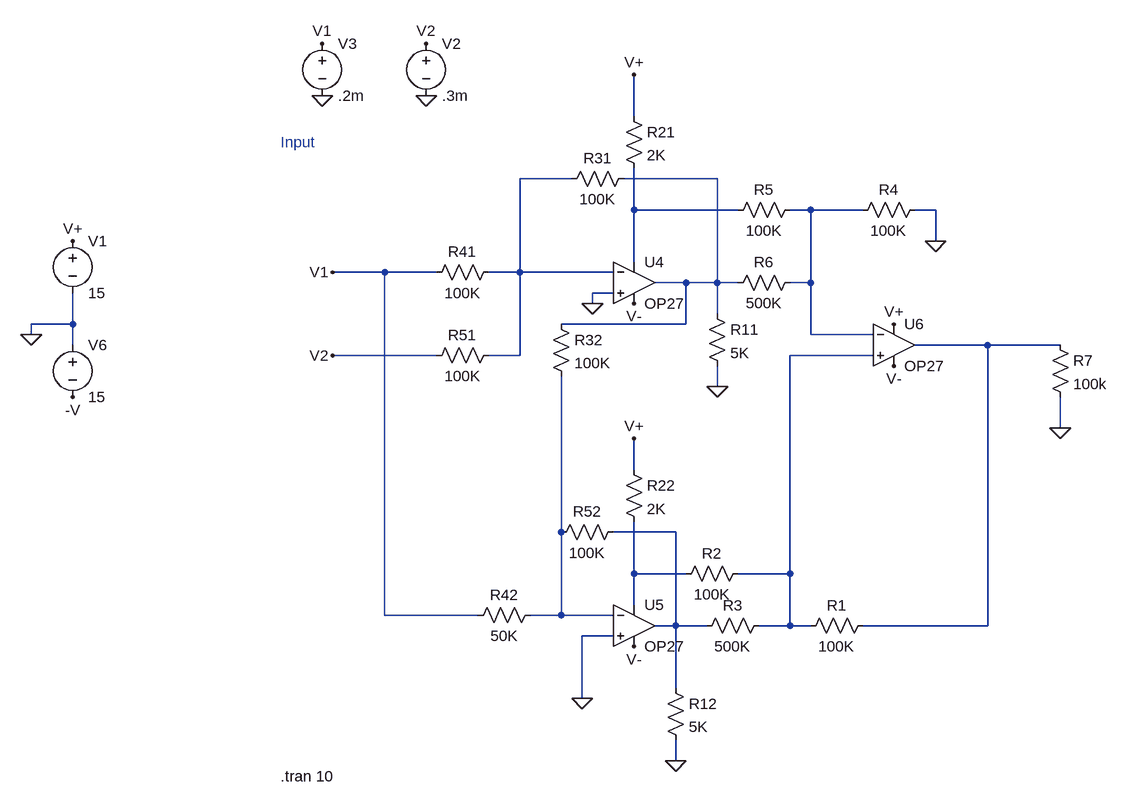
[diagram p0: schematic Multiplier.asc]
Multiplier.asc, the LTspice schematic file:
Version 4
SHEET 1 880 856
WIRE -160 -176 -160 -240
WIRE -256 -80 -336 -80
WIRE -32 -80 -176 -80
WIRE -160 -32 -160 -96
WIRE 0 -32 -160 -32
WIRE 112 -32 80 -32
WIRE 192 -32 112 -32
WIRE 304 -32 272 -32
WIRE 304 16 304 -32
WIRE -160 48 -160 -32
WIRE -544 64 -624 64
WIRE -464 64 -544 64
WIRE -336 64 -336 -80
WIRE -336 64 -384 64
WIRE -192 64 -336 64
WIRE -80 80 -128 80
WIRE -32 80 -32 -80
WIRE -32 80 -80 80
WIRE 0 80 -32 80
WIRE 112 80 112 -32
WIRE 112 80 80 80
WIRE -192 96 -224 96
WIRE -224 112 -224 96
WIRE -32 128 -32 80
WIRE -1024 144 -1024 96
WIRE -1024 144 -1088 144
WIRE -80 144 -80 80
WIRE -80 144 -272 144
WIRE -1088 160 -1088 144
WIRE 112 160 112 80
WIRE 208 160 112 160
WIRE -1024 176 -1024 144
WIRE 384 176 272 176
WIRE 496 176 384 176
WIRE -464 192 -624 192
WIRE -336 192 -336 64
WIRE -336 192 -384 192
WIRE 208 192 80 192
WIRE -32 240 -32 208
WIRE 496 304 496 256
WIRE -160 368 -160 320
WIRE -272 464 -272 224
WIRE -96 464 -192 464
WIRE -160 528 -160 448
WIRE -80 528 -160 528
WIRE 80 528 80 192
WIRE 80 528 0 528
WIRE -160 576 -160 528
WIRE -544 592 -544 64
WIRE -400 592 -544 592
WIRE -272 592 -272 464
WIRE -272 592 -320 592
WIRE -192 592 -272 592
WIRE -96 608 -96 464
WIRE -96 608 -128 608
WIRE -48 608 -96 608
WIRE 80 608 80 528
WIRE 80 608 32 608
WIRE 112 608 80 608
WIRE 384 608 384 176
WIRE 384 608 192 608
WIRE -192 624 -240 624
WIRE -96 704 -96 608
WIRE -240 720 -240 624
WIRE -96 816 -96 784
FLAG 304 16 0
FLAG -240 720 0
FLAG -32 240 0
FLAG -96 816 0
FLAG -224 112 0
FLAG 496 304 0
FLAG -160 -240 V+
FLAG -160 320 V+
FLAG 240 144 V+
FLAG -160 112 V-
FLAG -160 640 V-
FLAG 240 208 V-
FLAG -640 -208 0
FLAG -480 -208 0
FLAG -640 -288 V1
FLAG -480 -288 V2
FLAG -624 64 V1
FLAG -624 192 V2
FLAG -1088 160 0
FLAG -1024 16 V+
FLAG -1024 256 -V
SYMBOL res -176 -192 R0
SYMATTR InstName R21
SYMATTR Value 2K
SYMATTR SpiceLine tol=1
SYMBOL res -368 48 R90
WINDOW 0 0 56 VBottom 2
WINDOW 3 32 56 VTop 2
SYMATTR InstName R41
SYMATTR Value 100K
SYMATTR SpiceLine tol=1
SYMBOL res -368 176 R90
WINDOW 0 0 56 VBottom 2
WINDOW 3 32 56 VTop 2
SYMATTR InstName R51
SYMATTR Value 100K
SYMATTR SpiceLine tol=1
SYMBOL res -304 576 R90
WINDOW 0 0 56 VBottom 2
WINDOW 3 32 56 VTop 2
SYMATTR InstName R42
SYMATTR Value 50K
SYMATTR SpiceLine tol=1
SYMBOL res 96 64 R90
WINDOW 0 0 56 VBottom 2
WINDOW 3 32 56 VTop 2
SYMATTR InstName R6
SYMATTR Value 500K
SYMATTR SpiceLine tol=1
SYMBOL res 96 -48 R90
WINDOW 0 0 56 VBottom 2
WINDOW 3 32 56 VTop 2
SYMATTR InstName R5
SYMATTR Value 100K
SYMATTR SpiceLine tol=1
SYMBOL res -48 112 R0
SYMATTR InstName R11
SYMATTR Value 5K
SYMATTR SpiceLine tol=1
SYMBOL res -160 -96 R90
WINDOW 0 0 56 VBottom 2
WINDOW 3 32 56 VTop 2
SYMATTR InstName R31
SYMATTR Value 100K
SYMATTR SpiceLine tol=1
SYMBOL res 288 -48 R90
WINDOW 0 0 56 VBottom 2
WINDOW 3 32 56 VTop 2
SYMATTR InstName R4
SYMATTR Value 100K
SYMATTR SpiceLine tol=1
SYMBOL res -176 352 R0
SYMATTR InstName R22
SYMATTR Value 2K
SYMATTR SpiceLine tol=1
SYMBOL res 48 592 R90
WINDOW 0 0 56 VBottom 2
WINDOW 3 32 56 VTop 2
SYMATTR InstName R3
SYMATTR Value 500K
SYMATTR SpiceLine tol=1
SYMBOL res 208 592 R90
WINDOW 0 0 56 VBottom 2
WINDOW 3 32 56 VTop 2
SYMATTR InstName R1
SYMATTR Value 100K
SYMATTR SpiceLine tol=1
SYMBOL res 16 512 R90
WINDOW 0 0 56 VBottom 2
WINDOW 3 32 56 VTop 2
SYMATTR InstName R2
SYMATTR Value 100K
SYMATTR SpiceLine tol=1
SYMBOL res -176 448 R90
WINDOW 0 0 56 VBottom 2
WINDOW 3 32 56 VTop 2
SYMATTR InstName R52
SYMATTR Value 100K
SYMATTR SpiceLine tol=1
SYMBOL res -112 688 R0
SYMATTR InstName R12
SYMATTR Value 5K
SYMATTR SpiceLine tol=1
SYMBOL res -288 128 R0
SYMATTR InstName R32
SYMATTR Value 100K
SYMATTR SpiceLine tol=1
SYMBOL OpAmps\\OP27 -160 16 R0
SYMATTR InstName U4
SYMBOL OpAmps\\OP27 -160 544 R0
SYMATTR InstName U5
SYMBOL OpAmps\\OP27 240 112 R0
SYMATTR InstName U6
SYMBOL res 480 160 R0
SYMATTR InstName R7
SYMATTR Value 100k
SYMATTR SpiceLine tol=1
SYMBOL voltage -480 -304 R0
WINDOW 123 24 146 Left 2
WINDOW 39 24 125 Left 2
SYMATTR InstName V2
SYMATTR Value .3m
SYMBOL voltage -640 -304 R0
WINDOW 123 0 0 Left 2
WINDOW 39 0 0 Left 2
SYMATTR InstName V3
SYMATTR Value .2m
SYMBOL voltage -1024 0 R0
WINDOW 123 0 0 Left 0
WINDOW 39 0 0 Left 0
SYMATTR InstName V1
SYMATTR Value 15
SYMBOL voltage -1024 160 R0
WINDOW 123 0 0 Left 0
WINDOW 39 0 0 Left 0
SYMATTR InstName V6
SYMATTR Value 15
TEXT -704 -136 Left 2 ;Input
TEXT -704 840 Left 2 !.tran 10

The netlist it stands for:
* Multiplier.asc
R21 V+ N003 2K tol=1
R41 N001 V1 100K tol=1
R51 N001 V2 100K tol=1
R42 N007 V1 50K tol=1
R6 N004 N002 500K tol=1
R5 N004 N003 100K tol=1
R11 N002 0 5K tol=1
R31 N002 N001 100K tol=1
R4 0 N004 100K tol=1
R22 V+ N009 2K tol=1
R3 N006 N008 500K tol=1
R1 N005 N006 100K tol=1
R2 N006 N009 100K tol=1
R52 N008 N007 100K tol=1
R12 N008 0 5K tol=1
R32 N002 N007 100K tol=1
XU4 0 N001 N003 V- N002 OP27  ; pins In+ In- V+ V- OUT
XU5 0 N007 N009 V- N008 OP27  ; pins In+ In- V+ V- OUT
XU6 N006 N004 V+ V- N005 OP27  ; pins In+ In- V+ V- OUT
R7 N005 0 100k tol=1
V2 V2 0 .3m
V3 V1 0 .2m
V1 V+ 0 15
V6 0 -V 15
* Input
.tran 10
.lib ADI.lib
.backanno
.end